# EAGLE design MiP_ProtoPack (EAGLE 7.7.0)
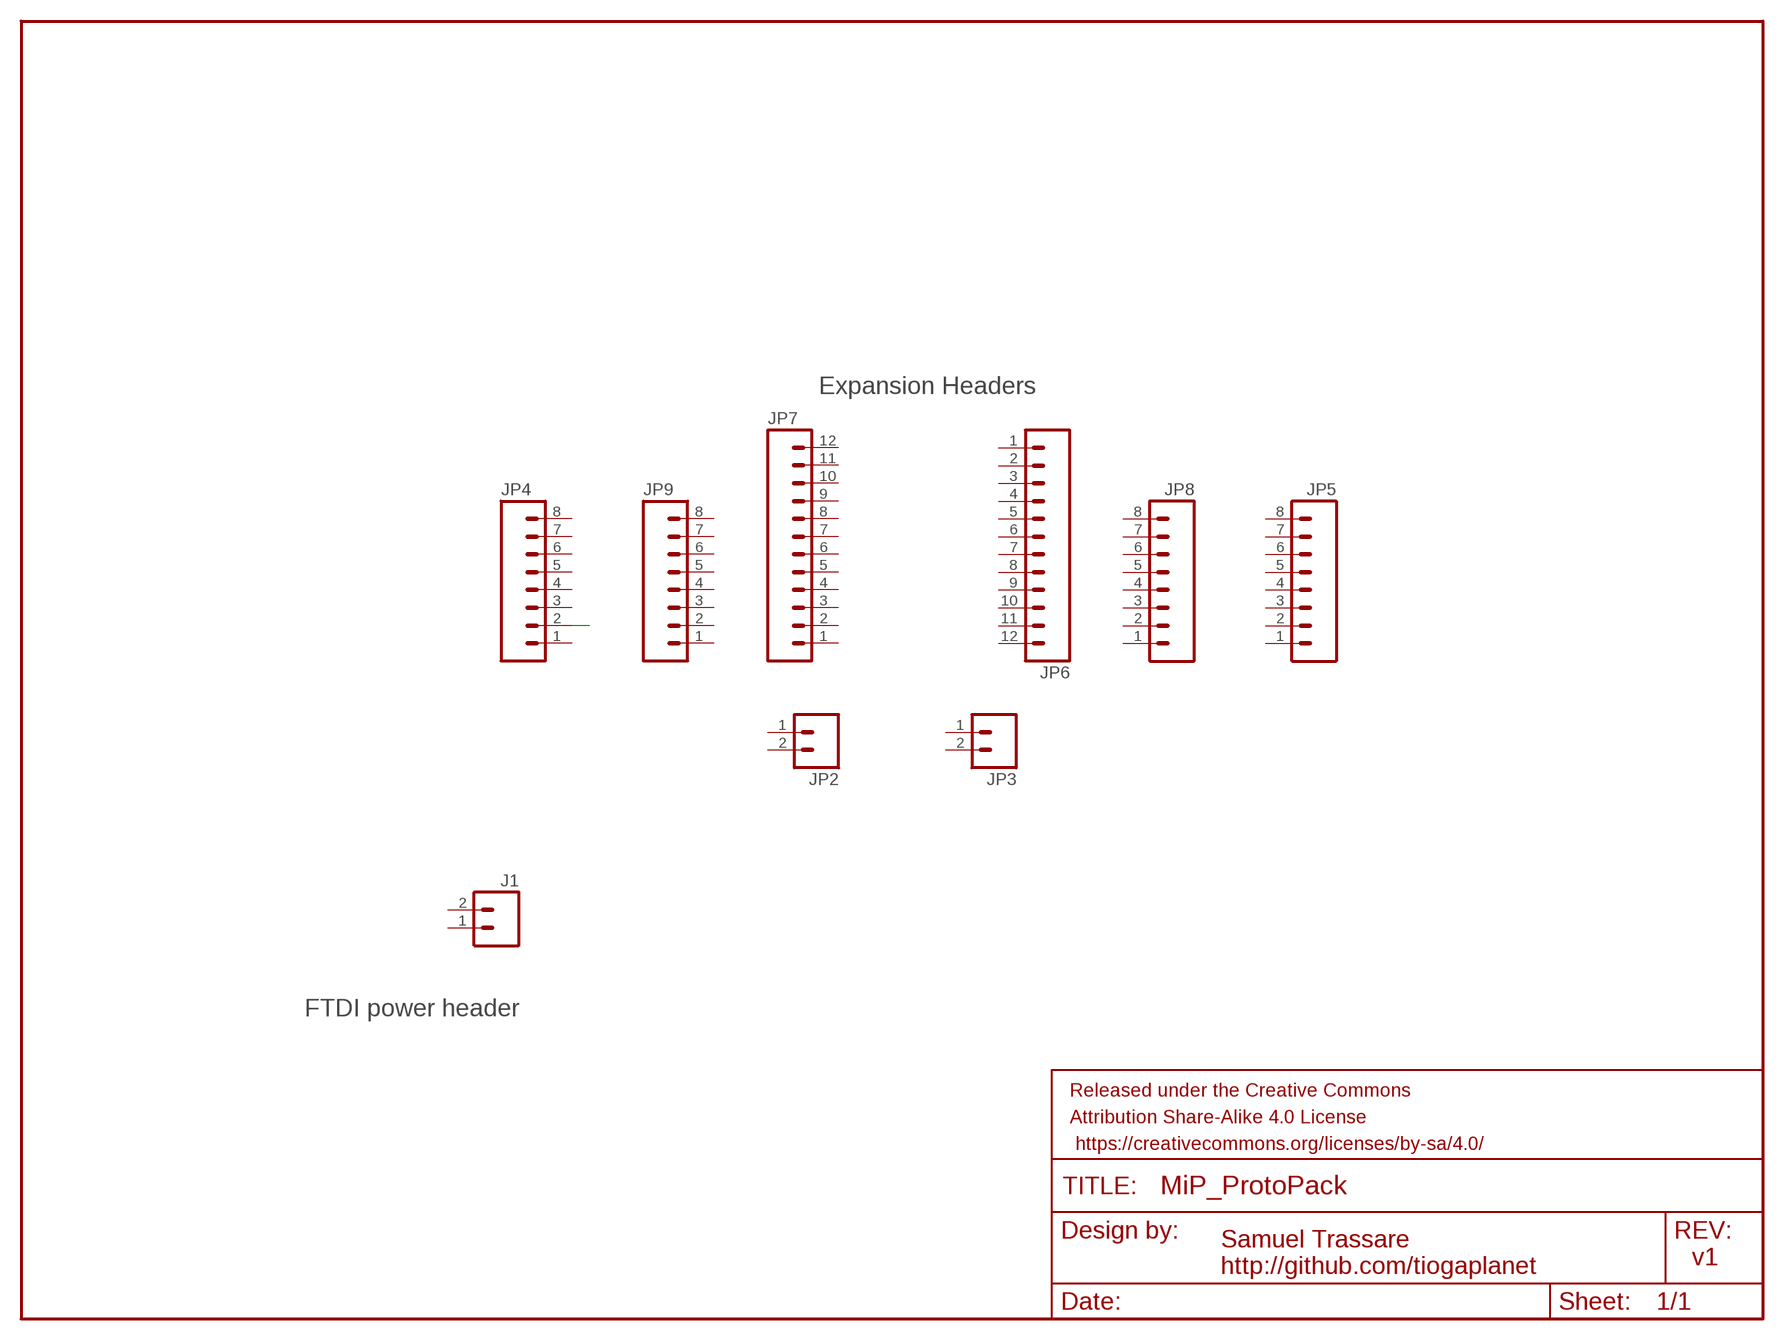
[diagram p0: schematic, sheet 1]

## Parts
FRAME1  FRAME-LETTER  [CREATIVE_COMMONS]
J1  M02PTH  [1X02]
JP2  M02PTH  [1X02]
JP3  M02PTH  [1X02]
JP4  M081X08  [1X08@1]
JP5  M081X08  [1X08@1]
JP6  M12PTH  [1X12]
JP7  M12PTH  [1X12]
JP8  M081X08  [1X08@1]
JP9  M081X08  [1X08@1]

## Nets
N$8: JP4.2
Unconnected: J1.1 J1.2 JP2.1 JP2.2 JP3.1 JP3.2 JP4.1 JP4.3 JP4.4 JP4.5 JP4.6 JP4.7 JP4.8 JP5.1 JP5.2 JP5.3 JP5.4 JP5.5 JP5.6 JP5.7 JP5.8 JP6.1 JP6.2 JP6.3 JP6.4 JP6.5 JP6.6 JP6.7 JP6.8 JP6.9 JP6.10 JP6.11 JP6.12 JP7.1 JP7.2 JP7.3 JP7.4 JP7.5 JP7.6 JP7.7 JP7.8 JP7.9 JP7.10 JP7.11 JP7.12 JP8.1 JP8.2 JP8.3 JP8.4 JP8.5 JP8.6 JP8.7 JP8.8 JP9.1 JP9.2 JP9.3 JP9.4 JP9.5 JP9.6 JP9.7 JP9.8

## Notes on the sheet
- Expansion Headers
- FTDI power header
- v1
- Samuel Trassare
  http://github.com/tiogaplanet

## Library data of the parts
FRAME1 = SparkFun-Aesthetics:FRAME-LETTER: Schematic Frame Standard 8.5x11 US Letter frame
J1 = SparkFun-Connectors:M02: Standard 2-pin 0.1" header. Use with - straight break away headers ( PRT-00116) - right angle break away headers (PRT-00553) - swiss pins (PRT-00743) - machine pins (PRT-00117) - female headers (PRT-00115) Molex polarized connector foot print use with: PRT-08233 with associated crimp pins and housings. 2.54_SCREWTERM for use with PRT-10571. 3.5mm Screw Terminal footprints for PRT-08084 5mm Screw Terminal footprints for use with PRT-08432
JP2 JP3 = SparkFun:M02: Header 2 Standard 2-pin 0.1" header. Use with straight break away headers (SKU : PRT-00116), right angle break away headers (PRT-00553), swiss pins (PRT-00743), machine pins (PRT-00117), and female headers (PRT-00115). Molex polarized connector foot print use with SKU : PRT-08233 with associated crimp pins and housings.
JP4 JP5 JP8 JP9 = SparkFun-Connectors:M08: Header 8 Standard 8-pin 0.1" header. Use with straight break away headers (SKU : PRT-00116), right angle break away headers (PRT-00553), swiss pins (PRT-00743), machine pins (PRT-00117), and female headers (PRT-00115).
JP6 JP7 = SparkFun:M12: Header 12 Standard 12-pin 0.1" header. Use with straight break away headers (SKU : PRT-00116), right angle break away headers (PRT-00553), swiss pins (PRT-00743), machine pins (PRT-00117), and female headers (PRT-00115).

## Net classes
0 default: width 0.203 mm
1 vcc: width 0.254 mm

## Board
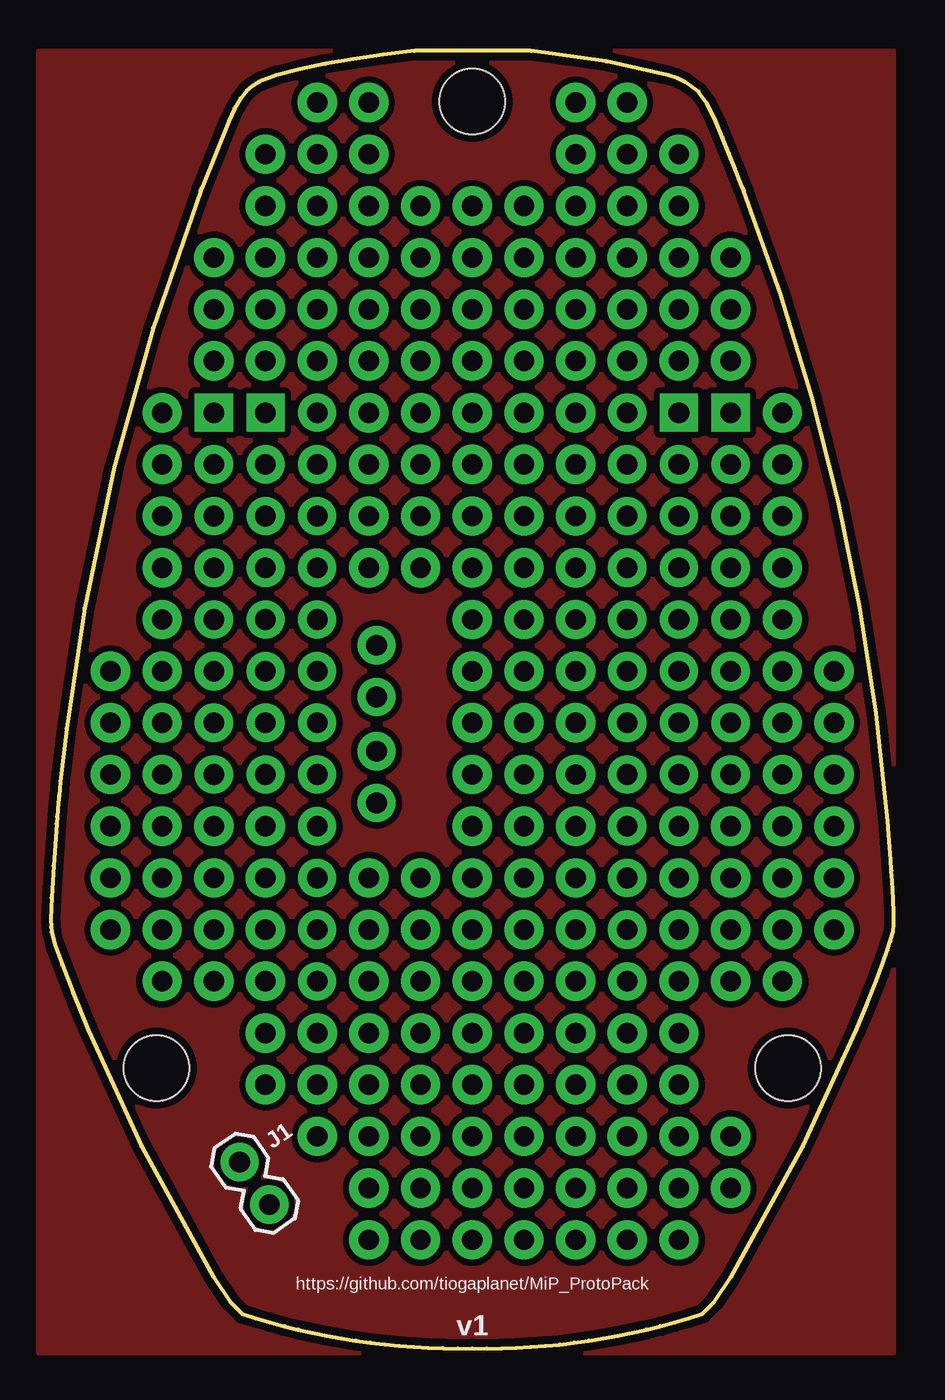
[diagram p1: board, top side]
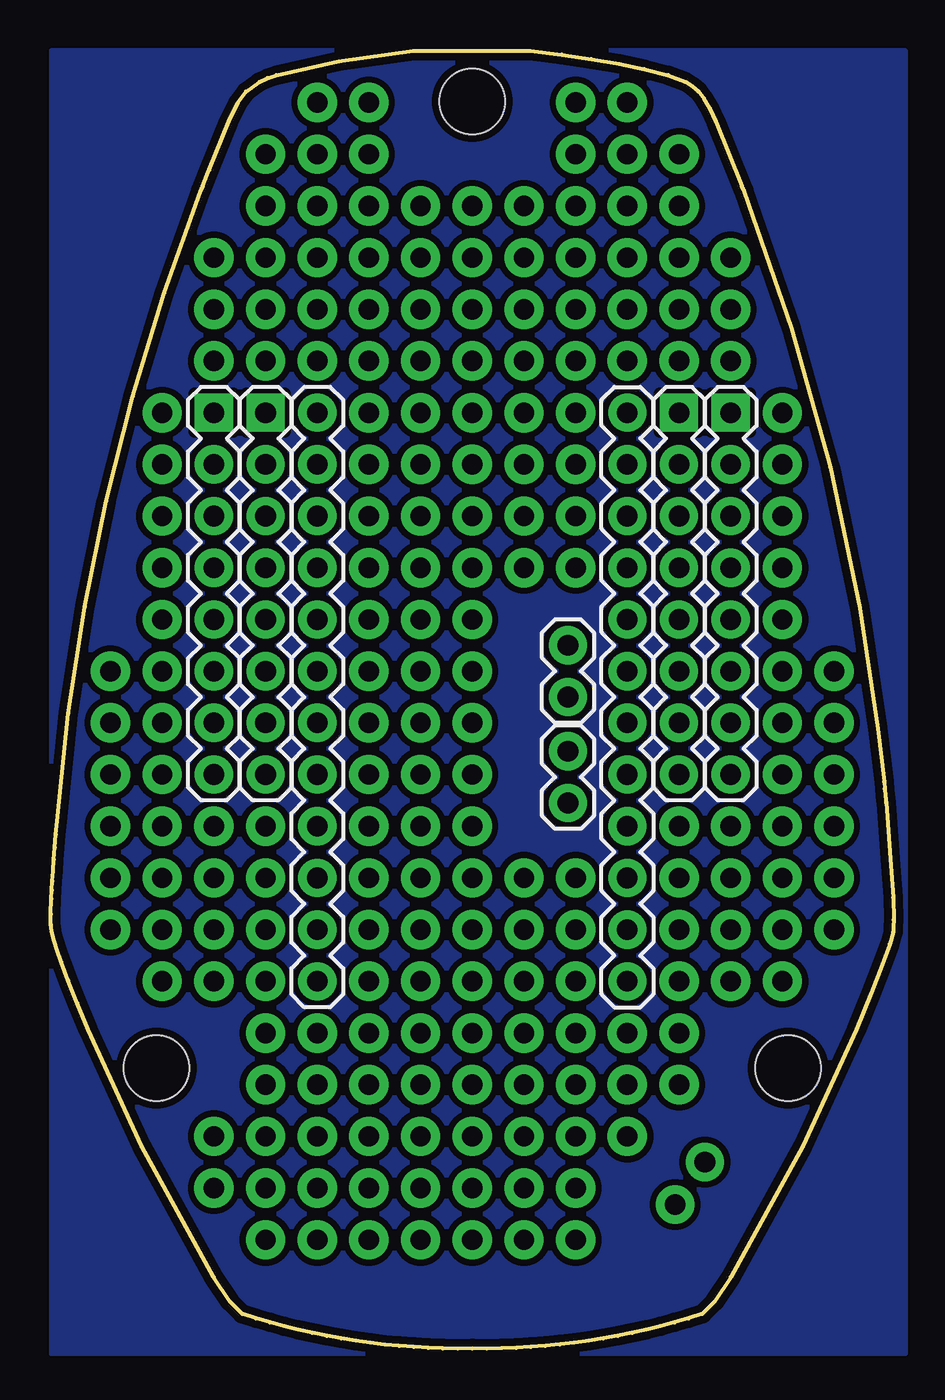
[diagram p2: board, bottom side, seen from below]

Size 41.42 x 63.77 mm. Coordinates in mm from the lower left corner, seen from the top.
Outline: 16.32,63.59 14.86,63.37 13.5,63.13 12.25,62.87 11.09,62.58 10.24,62.25 9.89,62.03 9.6,61.78 9.32,61.43 9.03,60.94 8.74,60.3 7.46,57.12 7.46,57.1 7.45,57.09 7.44,57.07 7.44,57.06 7.43,57.04 7.42,57.03 7.42,57.01 7.41,57 7.4,56.98 7.4,56.97 7.39,56.96 7.38,56.94 7.37,56.93 7.36,56.91 7.36,56.9 7.35,56.88 5.02,50.15 3.12,43.32 1.66,36.38 0.77,30.47 0.47,27.85 0.44,27.51 0.4,27.17 0.37,26.82 0.31,26.14 0.28,25.79 0.13,23.74 0.03,22.17 0,21.08 0.01,20.71 0.03,20.47 0.2,19.87 0.55,18.87 1.09,17.47 1.83,15.67 4.46,9.93 8.01,3.51 8.82,2.29 9.4,1.71 10.08,1.49 10.77,1.29 11.47,1.1 12.16,0.93 12.86,0.77 13.57,0.63 14.27,0.5 14.98,0.39 15.69,0.29 16.41,0.21 17.12,0.14 17.84,0.08 18.56,0.04 19.27,0.02 19.99,0 20.71,0.01 21.43,0 22.15,0.01 22.86,0.04 23.58,0.08 24.3,0.13 25.01,0.2 25.72,0.29 26.44,0.39 27.15,0.5 27.85,0.63 28.56,0.77 29.26,0.93 29.95,1.1 30.65,1.29 31.34,1.49 32.02,1.71 32.6,2.29 33.41,3.51 36.96,9.93 39.59,15.67 40.12,16.97 40.56,18.08 40.91,19 41.11,19.57 41.26,20.03 41.39,20.5 41.42,20.84 41.42,21.36 41.4,22.11 41.37,22.52 41.35,22.98 41.31,23.48 41.27,24.03 41.23,24.62 41.18,25.26 41.12,25.94 40.56,31.21 39.75,36.45 38.69,41.65 37.39,46.79 35.85,51.87 34.07,56.88 34.06,56.9 34.05,56.91 34.05,56.93 34.04,56.94 34.03,56.96 34.02,56.97 34.02,56.98 34.01,57 34,57.01 33.99,57.03 33.99,57.04 33.98,57.06 33.98,57.07 33.97,57.09 33.96,57.1 33.96,57.12 33.64,57.92 33.33,58.72 33.01,59.51 32.68,60.3 32.24,61.2 31.83,61.77 31.18,62.24 30.78,62.43 30.33,62.58 27.28,63.25 23.6,63.77 17.87,63.77 16.32,63.59
Copper layers (1*16): Top 0.035559375mm / dielectric 1.6mm / Bottom 0.035559375mm
Design rules "oshpark-2layer": minimum track width 6mil, minimum drill 10mil, track to track 6mil, track to pad 6mil, pad to pad 6mil, via to via 6mil, smd to smd 6mil, copper to edge 15mil, drill to drill 6mil, minimum pad ring 5mil, minimum via ring 5mil, stop-mask expansion 2.5mil, vias tented up to drill 0mil, thermal gap 10mil
Holes 3.2 mm at 20.71,61.28 5.19,13.78 36.23,13.78

### Footprints (pad centres in the part's own frame; a part is rotated, then mirrored left to right if it is on the bottom)
1X02 = drill 1.016 pad 1.88: 1 0,0; 2 2.54,0
1X08@1 = drill 1.016 pad 1.88 square: 1 0,0 | drill 1.016 pad 1.88: 2 2.54,0; 3 5.08,0; 4 7.62,0; 5 10.16,0; 6 12.7,0; 7 15.24,0; 8 17.78,0
1X12 = drill 1.016 pad 1.88: 1 0,0; 2 2.54,0; 3 5.08,0; 4 7.62,0; 5 10.16,0; 6 12.7,0; 7 15.24,0; 8 17.78,0; 9 20.32,0; 10 22.86,0; 11 25.4,0; 12 27.94,0

### Placement (x,y rotation side)
FRAME1  4.43,-9.76 0 top  (outside the outline)
J1  9.28,9.16 305 top
JP2  16.01,29.35 270 bottom
JP3  16.01,34.56 270 bottom
JP4  33.41,45.99 270 bottom
JP5  8.01,45.99 270 bottom
JP6  13.09,18.05 90 bottom
JP7  28.33,45.99 270 bottom
JP8  30.87,45.99 270 bottom
JP9  10.55,45.99 270 bottom

### Tracks (layer width: path | path; a pad name or v marks a point on that pad's centre or on a via)
GND
  pour Bottom (isolate 0.305): 41.41,63.77 41.41,-0.23 -0.59,-0.23 -0.59,63.77
  pour Top (isolate 0.305, rank 6): 41.41,63.77 41.41,-0.23 -0.59,-0.23 -0.59,63.77
N$1  (via drill 1 pad 1.93)
  other vias: 10.55,25.67
N$2  (via drill 1 pad 1.93)
  other vias: 33.41,20.59 35.95,20.59 38.49,20.59
N$3  (via drill 1 pad 1.93)
  other vias: 5.47,23.13
N$4  (via drill 1 pad 1.93)
  other vias: 5.47,25.67
N$5  (via drill 1 pad 1.93)
  other vias: 5.47,28.21
N$6  (via drill 1 pad 1.93)
  other vias: 5.47,30.75
N$7  (via drill 1 pad 1.93)
  other vias: 5.47,33.29
N$9  (via drill 1 pad 1.93)
  other vias: 10.55,23.13
N$10  (via drill 1 pad 1.93)
  other vias: 10.55,20.59
N$11  (via drill 1 pad 1.93)
  other vias: 8.01,23.13
N$12  (via drill 1 pad 1.93)
  other vias: 5.47,20.59
N$13  (via drill 1 pad 1.93)
  other vias: 8.01,25.67
N$15  (via drill 1 pad 1.93)
  other vias: 8.01,20.59
N$16  (via drill 1 pad 1.93)
  other vias: 25.79,56.15
N$17  (via drill 1 pad 1.93)
  other vias: 23.25,56.15
N$18  (via drill 1 pad 1.93)
  other vias: 20.71,56.15
N$19  (via drill 1 pad 1.93)
  other vias: 18.17,56.15
N$20  (via drill 1 pad 1.93)
  other vias: 15.63,56.15
N$21  (via drill 1 pad 1.93)
  other vias: 10.55,58.69
N$22  (via drill 1 pad 1.93)
  other vias: 13.09,58.69
N$23  (via drill 1 pad 1.93)
  other vias: 15.63,58.69
N$24  (via drill 1 pad 1.93)
  other vias: 15.63,38.37
N$25  (via drill 1 pad 1.93)
  other vias: 28.33,58.69 28.33,61.23
N$26  (via drill 1 pad 1.93)
  other vias: 30.87,58.69
N$27  (via drill 1 pad 1.93)
  other vias: 25.79,58.69 25.79,61.23
N$28  (via drill 1 pad 1.93)
  other vias: 13.09,61.23
N$29  (via drill 1 pad 1.93)
  other vias: 15.63,61.23
N$30  (via drill 1 pad 1.93)
  other vias: 15.63,23.13
N$31  (via drill 1 pad 1.93)
  other vias: 15.63,20.59
N$32  (via drill 1 pad 1.93)
  other vias: 20.71,20.59
N$33  (via drill 1 pad 1.93)
  other vias: 18.17,20.59
N$34  (via drill 1 pad 1.93)
  other vias: 18.17,23.13
N$35  (via drill 1 pad 1.93)
  other vias: 2.93,23.13
N$36  (via drill 1 pad 1.93)
  other vias: 2.93,33.29
N$37  (via drill 1 pad 1.93)
  other vias: 2.93,30.75
N$38  (via drill 1 pad 1.93)
  other vias: 2.93,28.21
N$39  (via drill 1 pad 1.93)
  other vias: 2.93,25.67
N$40  (via drill 1 pad 1.93)
  other vias: 18.17,38.37
N$41  (via drill 1 pad 1.93)
  other vias: 18.17,40.91
N$42  (via drill 1 pad 1.93)
  other vias: 15.63,40.91
N$43  (via drill 1 pad 1.93)
  other vias: 2.93,20.59
N$46  (via drill 1 pad 1.93)
  other vias: 5.47,40.91
N$47  (via drill 1 pad 1.93)
  other vias: 5.47,38.37
N$48  (via drill 1 pad 1.93)
  other vias: 5.47,35.83
N$49  (via drill 1 pad 1.93)
  other vias: 20.71,40.91
N$50  (via drill 1 pad 1.93)
  other vias: 20.71,35.83
N$51  (via drill 1 pad 1.93)
  other vias: 20.71,38.37
N$52  (via drill 1 pad 1.93)
  other vias: 20.71,33.29
N$53  (via drill 1 pad 1.93)
  other vias: 20.71,30.75
N$54  (via drill 1 pad 1.93)
  other vias: 20.71,28.21
N$55  (via drill 1 pad 1.93)
  other vias: 20.71,25.67
N$56  (via drill 1 pad 1.93)
  other vias: 20.71,23.13
N$57  (via drill 1 pad 1.93)
  other vias: 23.25,20.59
N$58  (via drill 1 pad 1.93)
  other vias: 23.25,23.13
N$59  (via drill 1 pad 1.93)
  other vias: 23.25,25.67
N$60  (via drill 1 pad 1.93)
  other vias: 23.25,28.21
N$61  (via drill 1 pad 1.93)
  other vias: 23.25,30.75
N$62  (via drill 1 pad 1.93)
  other vias: 23.25,35.83
N$63  (via drill 1 pad 1.93)
  other vias: 23.25,38.37
N$64  (via drill 1 pad 1.93)
  other vias: 23.25,40.91
N$65  (via drill 1 pad 1.93)
  other vias: 25.79,40.91
N$66  (via drill 1 pad 1.93)
  other vias: 25.79,38.37
N$67  (via drill 1 pad 1.93)
  other vias: 25.79,35.83
N$68  (via drill 1 pad 1.93)
  other vias: 23.25,33.29
N$69  (via drill 1 pad 1.93)
  other vias: 25.79,33.29
N$70  (via drill 1 pad 1.93)
  other vias: 25.79,30.75
N$71  (via drill 1 pad 1.93)
  other vias: 25.79,28.21
N$72  (via drill 1 pad 1.93)
  other vias: 25.79,25.67
N$73  (via drill 1 pad 1.93)
  other vias: 25.79,23.13
N$74  (via drill 1 pad 1.93)
  other vias: 25.79,20.59
N$75  (via drill 1 pad 1.93)
  other vias: 30.87,20.59
N$90  (via drill 1 pad 1.93)
  other vias: 30.87,25.67
N$91  (via drill 1 pad 1.93)
  other vias: 30.87,23.13
N$99  (via drill 1 pad 1.93)
  other vias: 33.41,25.67 33.41,23.13 35.95,23.13 38.49,23.13
N$100  (via drill 1 pad 1.93)
  other vias: 35.95,25.67
N$101  (via drill 1 pad 1.93)
  other vias: 35.95,28.21
N$102  (via drill 1 pad 1.93)
  other vias: 35.95,30.75
N$103  (via drill 1 pad 1.93)
  other vias: 35.95,33.29
N$104  (via drill 1 pad 1.93)
  other vias: 35.95,35.83
N$105  (via drill 1 pad 1.93)
  other vias: 35.95,38.37
N$106  (via drill 1 pad 1.93)
  other vias: 35.95,40.91
N$107  (via drill 1 pad 1.93)
  other vias: 38.49,33.29
N$108  (via drill 1 pad 1.93)
  other vias: 38.49,30.75
N$109  (via drill 1 pad 1.93)
  other vias: 38.49,28.21
N$110  (via drill 1 pad 1.93)
  other vias: 38.49,25.67
N$111  (via drill 1 pad 1.93)
  other vias: 30.87,18.05
N$112  (via drill 1 pad 1.93)
  other vias: 30.87,15.51
N$113  (via drill 1 pad 1.93)
  other vias: 30.87,12.97
N$114  (via drill 1 pad 1.93)
  other vias: 30.87,10.43
N$116  (via drill 1 pad 1.93)
  other vias: 23.25,18.05
N$117  (via drill 1 pad 1.93)
  other vias: 25.79,18.05
N$118  (via drill 1 pad 1.93)
  other vias: 20.71,18.05
N$119  (via drill 1 pad 1.93)
  other vias: 18.17,18.05
N$120  (via drill 1 pad 1.93)
  other vias: 15.63,18.05
N$122  (via drill 1 pad 1.93)
  other vias: 10.55,18.05
N$123  (via drill 1 pad 1.93)
  other vias: 10.55,15.51
N$124  (via drill 1 pad 1.93)
  other vias: 10.55,12.97
N$126  (via drill 1 pad 1.93)
  other vias: 13.09,10.43
N$127  (via drill 1 pad 1.93)
  other vias: 13.09,12.97
N$128  (via drill 1 pad 1.93)
  other vias: 13.09,15.51
N$129  (via drill 1 pad 1.93)
  other vias: 15.63,15.51
N$130  (via drill 1 pad 1.93)
  other vias: 20.71,15.51
N$131  (via drill 1 pad 1.93)
  other vias: 18.17,15.51
N$132  (via drill 1 pad 1.93)
  other vias: 23.25,15.51
N$133  (via drill 1 pad 1.93)
  other vias: 25.79,15.51
N$134  (via drill 1 pad 1.93)
  other vias: 28.33,15.51
N$135  (via drill 1 pad 1.93)
  other vias: 28.33,12.97
N$136  (via drill 1 pad 1.93)
  other vias: 25.79,12.97
N$137  (via drill 1 pad 1.93)
  other vias: 23.25,12.97
N$138  (via drill 1 pad 1.93)
  other vias: 20.71,12.97
N$139  (via drill 1 pad 1.93)
  other vias: 18.17,12.97
N$140  (via drill 1 pad 1.93)
  other vias: 15.63,12.97
N$141  (via drill 1 pad 1.93)
  other vias: 15.63,10.43
N$142  (via drill 1 pad 1.93)
  other vias: 20.71,10.43
N$143  (via drill 1 pad 1.93)
  other vias: 18.17,10.43
N$144  (via drill 1 pad 1.93)
  other vias: 23.25,10.43
N$145  (via drill 1 pad 1.93)
  other vias: 25.79,10.43
N$146  (via drill 1 pad 1.93)
  other vias: 28.33,10.43
N$147  (via drill 1 pad 1.93)
  other vias: 30.87,7.89
N$148  (via drill 1 pad 1.93)
  other vias: 30.87,5.35
N$149  (via drill 1 pad 1.93)
  other vias: 28.33,5.35
N$150  (via drill 1 pad 1.93)
  other vias: 25.79,5.35
N$151  (via drill 1 pad 1.93)
  other vias: 20.71,5.35
N$152  (via drill 1 pad 1.93)
  other vias: 15.63,5.35
N$157  (via drill 1 pad 1.93)
  other vias: 15.63,7.89
N$158  (via drill 1 pad 1.93)
  other vias: 18.17,7.89
N$159  (via drill 1 pad 1.93)
  other vias: 20.71,7.89
N$160  (via drill 1 pad 1.93)
  other vias: 23.25,7.89
N$161  (via drill 1 pad 1.93)
  other vias: 25.79,7.89
N$162  (via drill 1 pad 1.93)
  other vias: 28.33,7.89
N$163  (via drill 1 pad 1.93)
  other vias: 23.25,5.35
N$164  (via drill 1 pad 1.93)
  other vias: 18.17,5.35
N$167  (via drill 1 pad 1.93)
  other vias: 8.01,18.05
N$168  (via drill 1 pad 1.93)
  other vias: 33.41,18.05
N$169  (via drill 1 pad 1.93)
  other vias: 33.41,10.43
N$170  (via drill 1 pad 1.93)
  other vias: 33.41,7.89
N$177  (via drill 1 pad 1.93)
  other vias: 5.47,43.45
N$181  (via drill 1 pad 1.93)
  other vias: 15.63,43.45
N$182  (via drill 1 pad 1.93)
  other vias: 18.17,43.45
N$183  (via drill 1 pad 1.93)
  other vias: 20.71,43.45
N$184  (via drill 1 pad 1.93)
  other vias: 23.25,43.45
N$185  (via drill 1 pad 1.93)
  other vias: 25.79,43.45
N$189  (via drill 1 pad 1.93)
  other vias: 35.95,43.45
N$190  (via drill 1 pad 1.93)
  other vias: 35.95,45.99
N$194  (via drill 1 pad 1.93)
  other vias: 25.79,45.99
N$195  (via drill 1 pad 1.93)
  other vias: 23.25,45.99
N$196  (via drill 1 pad 1.93)
  other vias: 20.71,45.99
N$197  (via drill 1 pad 1.93)
  other vias: 18.17,45.99
N$198  (via drill 1 pad 1.93)
  other vias: 15.63,45.99
N$202  (via drill 1 pad 1.93)
  other vias: 5.47,45.99
N$203  (via drill 1 pad 1.93)
  other vias: 8.01,48.53
N$204  (via drill 1 pad 1.93)
  other vias: 10.55,48.53
N$205  (via drill 1 pad 1.93)
  other vias: 13.09,48.53
N$206  (via drill 1 pad 1.93)
  other vias: 15.63,48.53
N$207  (via drill 1 pad 1.93)
  other vias: 18.17,48.53
N$208  (via drill 1 pad 1.93)
  other vias: 20.71,48.53
N$209  (via drill 1 pad 1.93)
  other vias: 23.25,48.53
N$210  (via drill 1 pad 1.93)
  other vias: 25.79,48.53
N$211  (via drill 1 pad 1.93)
  other vias: 28.33,48.53
N$212  (via drill 1 pad 1.93)
  other vias: 30.87,48.53
N$213  (via drill 1 pad 1.93)
  other vias: 33.41,48.53
N$214  (via drill 1 pad 1.93)
  other vias: 33.41,51.07
N$215  (via drill 1 pad 1.93)
  other vias: 33.41,53.61
N$216  (via drill 1 pad 1.93)
  other vias: 30.87,51.07
N$217  (via drill 1 pad 1.93)
  other vias: 30.87,53.61
N$218  (via drill 1 pad 1.93)
  other vias: 28.33,53.61
N$219  (via drill 1 pad 1.93)
  other vias: 28.33,51.07
N$220  (via drill 1 pad 1.93)
  other vias: 25.79,51.07
N$221  (via drill 1 pad 1.93)
  other vias: 25.79,53.61
N$222  (via drill 1 pad 1.93)
  other vias: 23.25,53.61
N$223  (via drill 1 pad 1.93)
  other vias: 23.25,51.07
N$224  (via drill 1 pad 1.93)
  other vias: 20.71,51.07
N$225  (via drill 1 pad 1.93)
  other vias: 20.71,53.61
N$226  (via drill 1 pad 1.93)
  other vias: 18.17,53.61
N$227  (via drill 1 pad 1.93)
  other vias: 18.17,51.07
N$228  (via drill 1 pad 1.93)
  other vias: 15.63,51.07
N$229  (via drill 1 pad 1.93)
  other vias: 15.63,53.61
N$230  (via drill 1 pad 1.93)
  other vias: 13.09,53.61
N$231  (via drill 1 pad 1.93)
  other vias: 13.09,51.07
N$232  (via drill 1 pad 1.93)
  other vias: 10.55,51.07
N$233  (via drill 1 pad 1.93)
  other vias: 10.55,53.61
N$234  (via drill 1 pad 1.93)
  other vias: 8.01,53.61
N$235  (via drill 1 pad 1.93)
  other vias: 8.01,51.07
N$236  (via drill 1 pad 1.93)
  other vias: 10.55,56.15
N$239  (via drill 1 pad 1.93)
  other vias: 13.09,56.15
N$249  (via drill 1 pad 1.93)
  other vias: 28.33,56.15
N$250  (via drill 1 pad 1.93)
  other vias: 30.87,56.15
N$251  (via drill 1 pad 1.93)
  other vias: 35.95,18.05
N$252  (via drill 1 pad 1.93)
  other vias: 5.47,18.05

### Text on the board
tPlace: https://github.com/tiogaplanet/MiP_ProtoPack | v1
tDocu: Samuel Trassare